# Altium project KeyboardMoudle.PrjPCB
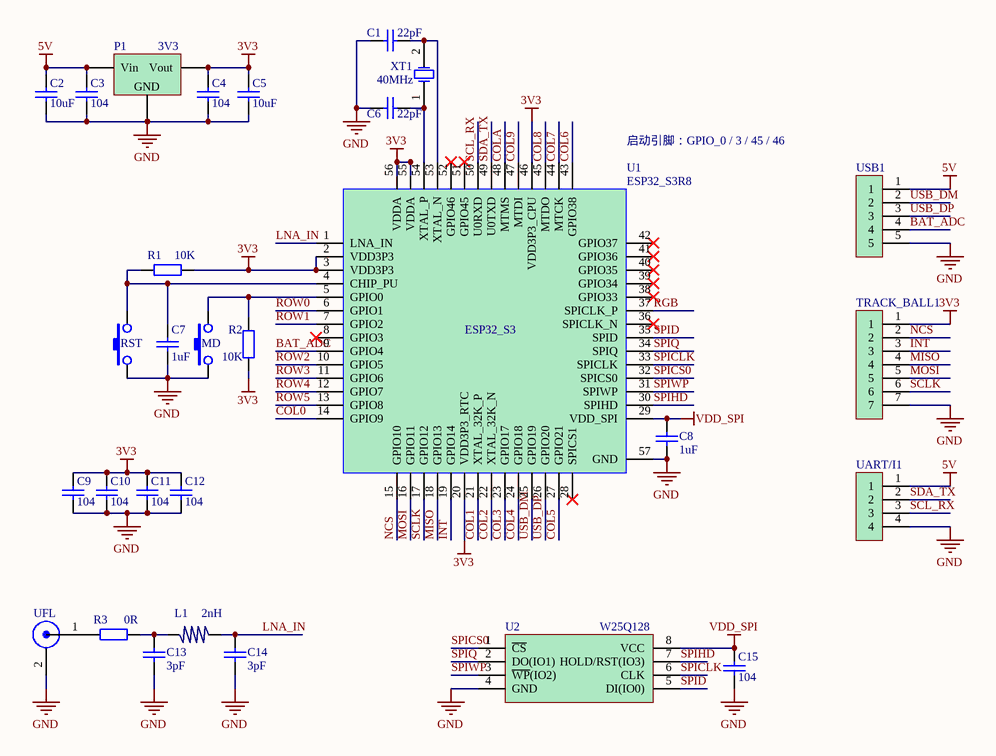
[diagram p0: KeyboardMoudle1.SchDoc]
3 sheets, 309 parts. Net scope: global (net labels, ports and power ports of the same name join across sheets).
Board file: KeyboardMoudle.PcbDoc
Sheets:
  KeyboardMoudle1.SchDoc
  KeyboardMoudle2.SchDoc
  KeyboardMoudle3.SchDoc

## Sheet KeyboardMoudle1.SchDoc
size A4

### Parts
C1  22pF  [0603]
C2  10uF  [0603]
C3  104  [0603]
C4  104  [0603]
C5  10uF  [0603]
C6  22pF  [0603]
C7  1uF  [0603]
C8  1uF  [0603]
C9  104  [0603]
C10  104  [0603]
C11  104  [0603]
C12  104  [0603]
C13  3pF  [0603]
C14  3pF  [0603]
C15  104  [0603]
L1  2nH  [0603]
MD  KEY  [KEY_SMT_4_L]  (value not drawn)
P1  3V3  [SOT223]
R1  10K  [R_0603]
R2  10K  [R_0603]
R3  0R  [R_0603]
RST  KEY  [KEY_SMT_4_L]  (value not drawn)
TRACK_BALL1  SH1.25mm_7P  [SH1.25MM_7P]  (value not drawn)
U1  ESP32_S3R8  [QFN56]
U2  W25Q128  [SOIC8-208MIL]
UART/I1  SH1.25mm_4P  [SH1.25MM_4P]  (value not drawn)
UFL  UFL  [IPEX]  (value not drawn)
USB1  SH1.25mm_5P  [SH1.25MM_5P]  (value not drawn)
XT1  40MHz  [XTAL_5032]

### Nets
3V3: C4.2 C5.2 C9.2 C10.2 C11.2 C12.2 P1.2(Vout) R1.1 R2.1 TRACK_BALL1.1 U1.2(VDD3P3) U1.3(VDD3P3) U1.20(VDD3P3_RTC) U1.46(VDD3P3_CPU) U1.55(VDDA) U1.56(VDDA)
5V: C2.2 C3.2 P1.3(Vin) UART/I1.1 USB1.1
GND: C1.1 C2.1 C3.1 C4.1 C5.1 C6.2 C7.2 C8.2 C9.1 C10.1 C11.1 C12.1 C13.2 C14.2 C15.2 MD.1 P1.1(GND) RST.1 TRACK_BALL1.7 U1.57(GND) U2.4(GND) UART/I1.4 UFL.2 USB1.5
VDD_SPI: C8.1 C15.1 U1.29(VDD_SPI) U2.8(VCC)
BAT_ADC: U1.9(GPIO4) USB1.4
COL0: U1.14(GPIO9)
COL1: U1.21(XTAL_32K_P)
COL2: U1.22(XTAL_32K_N)
COL3: U1.23(GPIO17)
COL4: U1.24(GPIO18)
COL5: U1.27(GPIO21)
COL6: U1.43(GPIO38)
COL7: U1.44(MTCK)
COL8: U1.45(MTDO)
COL9: U1.47(MTDI)
COLA: U1.48(MTMS)
INT: TRACK_BALL1.3 U1.19(GPIO14)
LNA_IN: C14.1 L1.2 U1.1(LNA_IN)
MISO: TRACK_BALL1.4 U1.18(GPIO13)
MOSI: TRACK_BALL1.5 U1.16(GPIO11)
NCS: TRACK_BALL1.2 U1.15(GPIO10)
RGB: U1.37(SPICLK_P)
ROW0: U1.6(GPIO1)
ROW1: U1.7(GPIO2)
ROW2: U1.10(GPIO5)
ROW3: U1.11(GPIO6)
ROW4: U1.12(GPIO7)
ROW5: U1.13(GPIO8)
SCL_RX: U1.50(U0RXD) UART/I1.3
SCLK: TRACK_BALL1.6 U1.17(GPIO12)
SDA_TX: U1.49(U0TXD) UART/I1.2
SPICLK: U1.33(SPICLK) U2.6(CLK)
SPICS0: U1.32(SPICS0) U2.1(~{CS})
SPID: U1.35(SPID) U2.5(DI(IO0))
SPIHD: U1.30(SPIHD) U2.7(HOLD/RST(IO3))
SPIQ: U1.34(SPIQ) U2.2(DO(IO1))
SPIWP: U1.31(SPIWP) U2.3(~{WP}(IO2))
USB_DM: U1.25(GPIO19) USB1.2
USB_DP: U1.26(GPIO20) USB1.3
NetC1_2: C1.2 U1.53(XTAL_N) XT1.2(OSC2)
NetC6_1: C6.1 U1.54(XTAL_P) XT1.1(OSC1)
NetC7_1: C7.1 R1.2 RST.2 U1.4(CHIP_PU)
NetC13_1: C13.1 L1.1 R3.2
NetMD_2: MD.2 R2.2 U1.5(GPIO0)
NetR3_1: R3.1 UFL.1

Not connected (* = marked no-connect by the designer): U1 8(GPIO3)* 28(SPICS1)* 36(SPICLK_N)* 38(GPIO33)* 39(GPIO34)* 40(GPIO35)* 41(GPIO36)* 42(GPIO37)* 51(GPIO45)* 52(GPIO46)*

### Notes on the sheet
- (near U1) 启动引脚：GPIO_0 / 3 / 45 / 46

### Library data of the parts
C1-C15 = CAP_0603: 贴片电容 0603
L1 = L_0603: 电感 0603
MD RST = KEY_SMT_4_L: 卧式贴片按键 2*4*3.5mm
P1 = LDO_AMS1117: 线性稳压器
R1-R3 = RES_0603: 电阻 0603
U1 = ESP32_S3: ESP32
U2 = W25Q64: FLASH
UFL = UFL: 射频接口
XT1 = XTAL_5032: 贴片无源晶振

## Sheet KeyboardMoudle2.SchDoc
size A4
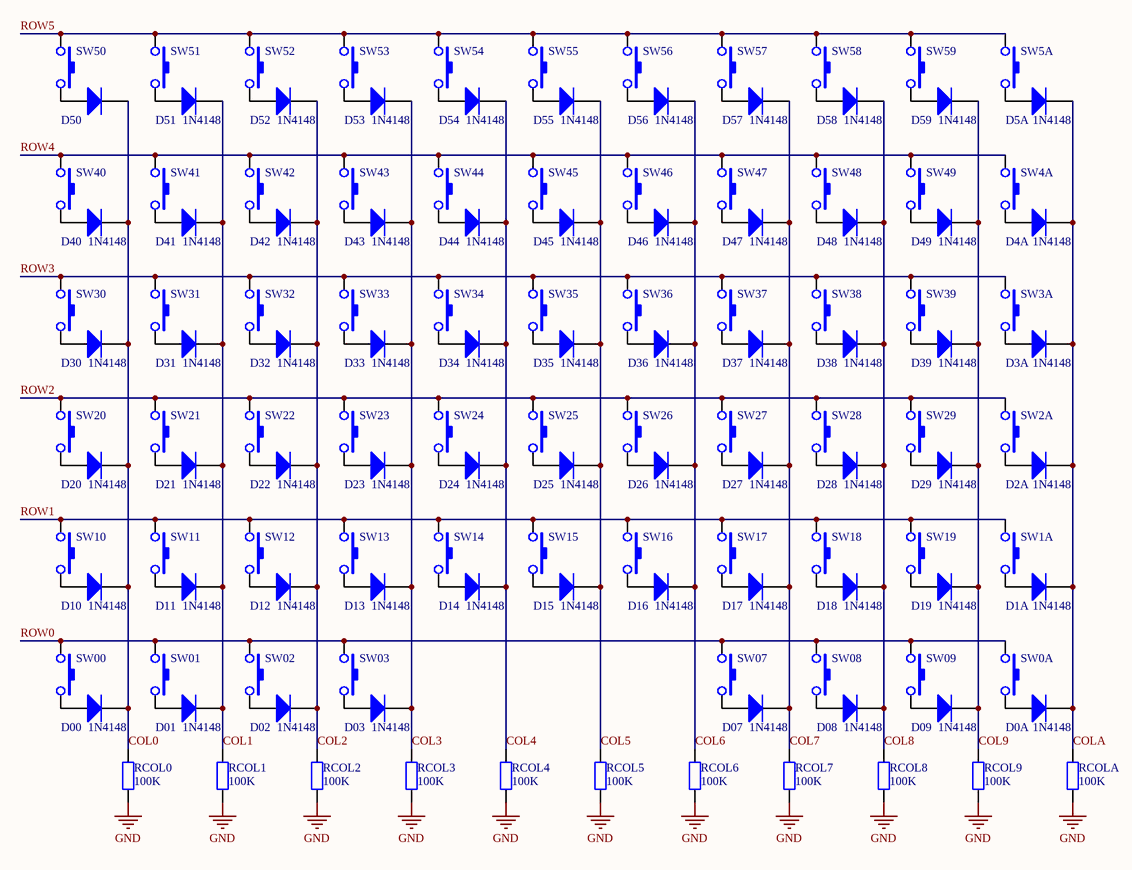
[diagram p1: KeyboardMoudle2.SchDoc]

### Parts
D00  1N4148  [SOD523]
D0A  1N4148  [SOD523]
D01  1N4148  [SOD523]
D1A  1N4148  [SOD523]
D02  1N4148  [SOD523]
D2A  1N4148  [SOD523]
D03  1N4148  [SOD523]
D3A  1N4148  [SOD523]
D4A  1N4148  [SOD523]
D5A  1N4148  [SOD523]
D07  1N4148  [SOD523]
D08  1N4148  [SOD523]
D09  1N4148  [SOD523]
D10  1N4148  [SOD523]
D11  1N4148  [SOD523]
D12  1N4148  [SOD523]
D13  1N4148  [SOD523]
D14  1N4148  [SOD523]
D15  1N4148  [SOD523]
D16  1N4148  [SOD523]
D17  1N4148  [SOD523]
D18  1N4148  [SOD523]
D19  1N4148  [SOD523]
D20  1N4148  [SOD523]
D21  1N4148  [SOD523]
D22  1N4148  [SOD523]
D23  1N4148  [SOD523]
D24  1N4148  [SOD523]
D25  1N4148  [SOD523]
D26  1N4148  [SOD523]
D27  1N4148  [SOD523]
D28  1N4148  [SOD523]
D29  1N4148  [SOD523]
D30  1N4148  [SOD523]
D31  1N4148  [SOD523]
D32  1N4148  [SOD523]
D33  1N4148  [SOD523]
D34  1N4148  [SOD523]
D35  1N4148  [SOD523]
D36  1N4148  [SOD523]
D37  1N4148  [SOD523]
D38  1N4148  [SOD523]
D39  1N4148  [SOD523]
D40  1N4148  [SOD523]
D41  1N4148  [SOD523]
D42  1N4148  [SOD523]
D43  1N4148  [SOD523]
D44  1N4148  [SOD523]
D45  1N4148  [SOD523]
D46  1N4148  [SOD523]
D47  1N4148  [SOD523]
D48  1N4148  [SOD523]
D49  1N4148  [SOD523]
D50  (no value)  [SOD523]
D51  1N4148  [SOD523]
D52  1N4148  [SOD523]
D53  1N4148  [SOD523]
D54  1N4148  [SOD523]
D55  1N4148  [SOD523]
D56  1N4148  [SOD523]
D57  1N4148  [SOD523]
D58  1N4148  [SOD523]
D59  1N4148  [SOD523]
RCOL0  100K  [R_0603]
RCOL1  100K  [R_0603]
RCOL2  100K  [R_0603]
RCOL3  100K  [R_0603]
RCOL4  100K  [R_0603]
RCOL5  100K  [R_0603]
RCOL6  100K  [R_0603]
RCOL7  100K  [R_0603]
RCOL8  100K  [R_0603]
RCOL9  100K  [R_0603]
RCOLA  100K  [R_0603]
SW00  SWITCH_KAILH_1350  [SWITCH_KAILH_1350]  (value not drawn)
SW0A  SWITCH_KAILH_1350  [SWITCH_KAILH_1350]  (value not drawn)
SW01  SWITCH_KAILH_1350  [SWITCH_KAILH_1350]  (value not drawn)
SW1A  SWITCH_KAILH_1350  [SWITCH_KAILH_1350]  (value not drawn)
SW02  SWITCH_KAILH_1350  [SWITCH_KAILH_1350]  (value not drawn)
SW2A  SWITCH_KAILH_1350  [SWITCH_KAILH_1350]  (value not drawn)
SW03  SWITCH_KAILH_1350  [SWITCH_KAILH_1350]  (value not drawn)
SW3A  SWITCH_KAILH_1350  [SWITCH_KAILH_1350]  (value not drawn)
SW4A  SWITCH_KAILH_1350  [SWITCH_KAILH_1350]  (value not drawn)
SW5A  SWITCH_KAILH_1350  [SWITCH_KAILH_1350]  (value not drawn)
SW07  SWITCH_KAILH_1350  [SWITCH_KAILH_1350]  (value not drawn)
SW08  SWITCH_KAILH_1350  [SWITCH_KAILH_1350]  (value not drawn)
SW09  SWITCH_KAILH_1350  [SWITCH_KAILH_1350]  (value not drawn)
SW10  SWITCH_KAILH_1350  [SWITCH_KAILH_1350]  (value not drawn)
SW11  SWITCH_KAILH_1350  [SWITCH_KAILH_1350]  (value not drawn)
SW12  SWITCH_KAILH_1350  [SWITCH_KAILH_1350]  (value not drawn)
SW13  SWITCH_KAILH_1350  [SWITCH_KAILH_1350]  (value not drawn)
SW14  SWITCH_KAILH_1350  [SWITCH_KAILH_1350]  (value not drawn)
SW15  SWITCH_KAILH_1350  [SWITCH_KAILH_1350]  (value not drawn)
SW16  SWITCH_KAILH_1350  [SWITCH_KAILH_1350]  (value not drawn)
SW17  SWITCH_KAILH_1350  [SWITCH_KAILH_1350]  (value not drawn)
SW18  SWITCH_KAILH_1350  [SWITCH_KAILH_1350]  (value not drawn)
SW19  SWITCH_KAILH_1350  [SWITCH_KAILH_1350]  (value not drawn)
SW20  SWITCH_KAILH_1350  [SWITCH_KAILH_1350]  (value not drawn)
SW21  SWITCH_KAILH_1350  [SWITCH_KAILH_1350]  (value not drawn)
SW22  SWITCH_KAILH_1350  [SWITCH_KAILH_1350]  (value not drawn)
SW23  SWITCH_KAILH_1350  [SWITCH_KAILH_1350]  (value not drawn)
SW24  SWITCH_KAILH_1350  [SWITCH_KAILH_1350]  (value not drawn)
SW25  SWITCH_KAILH_1350  [SWITCH_KAILH_1350]  (value not drawn)
SW26  SWITCH_KAILH_1350  [SWITCH_KAILH_1350]  (value not drawn)
SW27  SWITCH_KAILH_1350  [SWITCH_KAILH_1350]  (value not drawn)
SW28  SWITCH_KAILH_1350  [SWITCH_KAILH_1350]  (value not drawn)
SW29  SWITCH_KAILH_1350  [SWITCH_KAILH_1350]  (value not drawn)
SW30  SWITCH_KAILH_1350  [SWITCH_KAILH_1350]  (value not drawn)
SW31  SWITCH_KAILH_1350  [SWITCH_KAILH_1350]  (value not drawn)
SW32  SWITCH_KAILH_1350  [SWITCH_KAILH_1350]  (value not drawn)
SW33  SWITCH_KAILH_1350  [SWITCH_KAILH_1350]  (value not drawn)
SW34  SWITCH_KAILH_1350  [SWITCH_KAILH_1350]  (value not drawn)
SW35  SWITCH_KAILH_1350  [SWITCH_KAILH_1350]  (value not drawn)
SW36  SWITCH_KAILH_1350  [SWITCH_KAILH_1350]  (value not drawn)
SW37  SWITCH_KAILH_1350  [SWITCH_KAILH_1350]  (value not drawn)
SW38  SWITCH_KAILH_1350  [SWITCH_KAILH_1350]  (value not drawn)
SW39  SWITCH_KAILH_1350  [SWITCH_KAILH_1350]  (value not drawn)
SW40  SWITCH_KAILH_1350  [SWITCH_KAILH_1350]  (value not drawn)
SW41  SWITCH_KAILH_1350  [SWITCH_KAILH_1350]  (value not drawn)
SW42  SWITCH_KAILH_1350  [SWITCH_KAILH_1350]  (value not drawn)
SW43  SWITCH_KAILH_1350  [SWITCH_KAILH_1350]  (value not drawn)
SW44  SWITCH_KAILH_1350  [SWITCH_KAILH_1350]  (value not drawn)
SW45  SWITCH_KAILH_1350  [SWITCH_KAILH_1350]  (value not drawn)
SW46  SWITCH_KAILH_1350  [SWITCH_KAILH_1350]  (value not drawn)
SW47  SWITCH_KAILH_1350  [SWITCH_KAILH_1350]  (value not drawn)
SW48  SWITCH_KAILH_1350  [SWITCH_KAILH_1350]  (value not drawn)
SW49  SWITCH_KAILH_1350  [SWITCH_KAILH_1350]  (value not drawn)
SW50  SWITCH_KAILH_1350  [SWITCH_KAILH_1350]  (value not drawn)
SW51  SWITCH_KAILH_1350  [SWITCH_KAILH_1350]  (value not drawn)
SW52  SWITCH_KAILH_1350  [SWITCH_KAILH_1350]  (value not drawn)
SW53  SWITCH_KAILH_1350  [SWITCH_KAILH_1350]  (value not drawn)
SW54  SWITCH_KAILH_1350  [SWITCH_KAILH_1350]  (value not drawn)
SW55  SWITCH_KAILH_1350  [SWITCH_KAILH_1350]  (value not drawn)
SW56  SWITCH_KAILH_1350  [SWITCH_KAILH_1350]  (value not drawn)
SW57  SWITCH_KAILH_1350  [SWITCH_KAILH_1350]  (value not drawn)
SW58  SWITCH_KAILH_1350  [SWITCH_KAILH_1350]  (value not drawn)
SW59  SWITCH_KAILH_1350  [SWITCH_KAILH_1350]  (value not drawn)

### Nets
GND: RCOL0.1 RCOL1.1 RCOL2.1 RCOL3.1 RCOL4.1 RCOL5.1 RCOL6.1 RCOL7.1 RCOL8.1 RCOL9.1 RCOLA.1
COL0: D00.2(K) D10.2(K) D20.2(K) D30.2(K) D40.2(K) D50.2(K) RCOL0.2
COL1: D01.2(K) D11.2(K) D21.2(K) D31.2(K) D41.2(K) D51.2(K) RCOL1.2
COL2: D02.2(K) D12.2(K) D22.2(K) D32.2(K) D42.2(K) D52.2(K) RCOL2.2
COL3: D03.2(K) D13.2(K) D23.2(K) D33.2(K) D43.2(K) D53.2(K) RCOL3.2
COL4: D14.2(K) D24.2(K) D34.2(K) D44.2(K) D54.2(K) RCOL4.2
COL5: D15.2(K) D25.2(K) D35.2(K) D45.2(K) D55.2(K) RCOL5.2
COL6: D16.2(K) D26.2(K) D36.2(K) D46.2(K) D56.2(K) RCOL6.2
COL7: D07.2(K) D17.2(K) D27.2(K) D37.2(K) D47.2(K) D57.2(K) RCOL7.2
COL8: D08.2(K) D18.2(K) D28.2(K) D38.2(K) D48.2(K) D58.2(K) RCOL8.2
COL9: D09.2(K) D19.2(K) D29.2(K) D39.2(K) D49.2(K) D59.2(K) RCOL9.2
COLA: D0A.2(K) D1A.2(K) D2A.2(K) D3A.2(K) D4A.2(K) D5A.2(K) RCOLA.2
ROW0: SW00.1 SW0A.1 SW01.1 SW02.1 SW03.1 SW07.1 SW08.1 SW09.1
ROW1: SW1A.1 SW10.1 SW11.1 SW12.1 SW13.1 SW14.1 SW15.1 SW16.1 SW17.1 SW18.1 SW19.1
ROW2: SW2A.1 SW20.1 SW21.1 SW22.1 SW23.1 SW24.1 SW25.1 SW26.1 SW27.1 SW28.1 SW29.1
ROW3: SW3A.1 SW30.1 SW31.1 SW32.1 SW33.1 SW34.1 SW35.1 SW36.1 SW37.1 SW38.1 SW39.1
ROW4: SW4A.1 SW40.1 SW41.1 SW42.1 SW43.1 SW44.1 SW45.1 SW46.1 SW47.1 SW48.1 SW49.1
ROW5: SW5A.1 SW50.1 SW51.1 SW52.1 SW53.1 SW54.1 SW55.1 SW56.1 SW57.1 SW58.1 SW59.1
NetD00_1: D00.1(A) SW00.2
NetD0A_1: D0A.1(A) SW0A.2
NetD01_1: D01.1(A) SW01.2
NetD1A_1: D1A.1(A) SW1A.2
NetD02_1: D02.1(A) SW02.2
NetD2A_1: D2A.1(A) SW2A.2
NetD03_1: D03.1(A) SW03.2
NetD3A_1: D3A.1(A) SW3A.2
NetD4A_1: D4A.1(A) SW4A.2
NetD5A_1: D5A.1(A) SW5A.2
NetD07_1: D07.1(A) SW07.2
NetD08_1: D08.1(A) SW08.2
NetD09_1: D09.1(A) SW09.2
NetD10_1: D10.1(A) SW10.2
NetD11_1: D11.1(A) SW11.2
NetD12_1: D12.1(A) SW12.2
NetD13_1: D13.1(A) SW13.2
NetD14_1: D14.1(A) SW14.2
NetD15_1: D15.1(A) SW15.2
NetD16_1: D16.1(A) SW16.2
NetD17_1: D17.1(A) SW17.2
NetD18_1: D18.1(A) SW18.2
NetD19_1: D19.1(A) SW19.2
NetD20_1: D20.1(A) SW20.2
NetD21_1: D21.1(A) SW21.2
NetD22_1: D22.1(A) SW22.2
NetD23_1: D23.1(A) SW23.2
NetD24_1: D24.1(A) SW24.2
NetD25_1: D25.1(A) SW25.2
NetD26_1: D26.1(A) SW26.2
NetD27_1: D27.1(A) SW27.2
NetD28_1: D28.1(A) SW28.2
NetD29_1: D29.1(A) SW29.2
NetD30_1: D30.1(A) SW30.2
NetD31_1: D31.1(A) SW31.2
NetD32_1: D32.1(A) SW32.2
NetD33_1: D33.1(A) SW33.2
NetD34_1: D34.1(A) SW34.2
NetD35_1: D35.1(A) SW35.2
NetD36_1: D36.1(A) SW36.2
NetD37_1: D37.1(A) SW37.2
NetD38_1: D38.1(A) SW38.2
NetD39_1: D39.1(A) SW39.2
NetD40_1: D40.1(A) SW40.2
NetD41_1: D41.1(A) SW41.2
NetD42_1: D42.1(A) SW42.2
NetD43_1: D43.1(A) SW43.2
NetD44_1: D44.1(A) SW44.2
NetD45_1: D45.1(A) SW45.2
NetD46_1: D46.1(A) SW46.2
NetD47_1: D47.1(A) SW47.2
NetD48_1: D48.1(A) SW48.2
NetD49_1: D49.1(A) SW49.2
NetD50_1: D50.1(A) SW50.2
NetD51_1: D51.1(A) SW51.2
NetD52_1: D52.1(A) SW52.2
NetD53_1: D53.1(A) SW53.2
NetD54_1: D54.1(A) SW54.2
NetD55_1: D55.1(A) SW55.2
NetD56_1: D56.1(A) SW56.2
NetD57_1: D57.1(A) SW57.2
NetD58_1: D58.1(A) SW58.2
NetD59_1: D59.1(A) SW59.2

### Library data of the parts
D00 D0A D01 D1A D02 D2A D03 D3A D4A D5A D07 D08 D09-D59 = DIO_1N4148_SOD523: 开关二极管
RCOL0-RCOL9 RCOLA = RES_0603: 电阻 0603
SW00 SW0A SW01 SW1A SW02 SW2A SW03 SW3A SW4A SW5A SW07 SW08 SW09-SW59 = SWITCH_KAILH_1350: 凯华机械矮轴1350

## Sheet KeyboardMoudle3.SchDoc
size A4
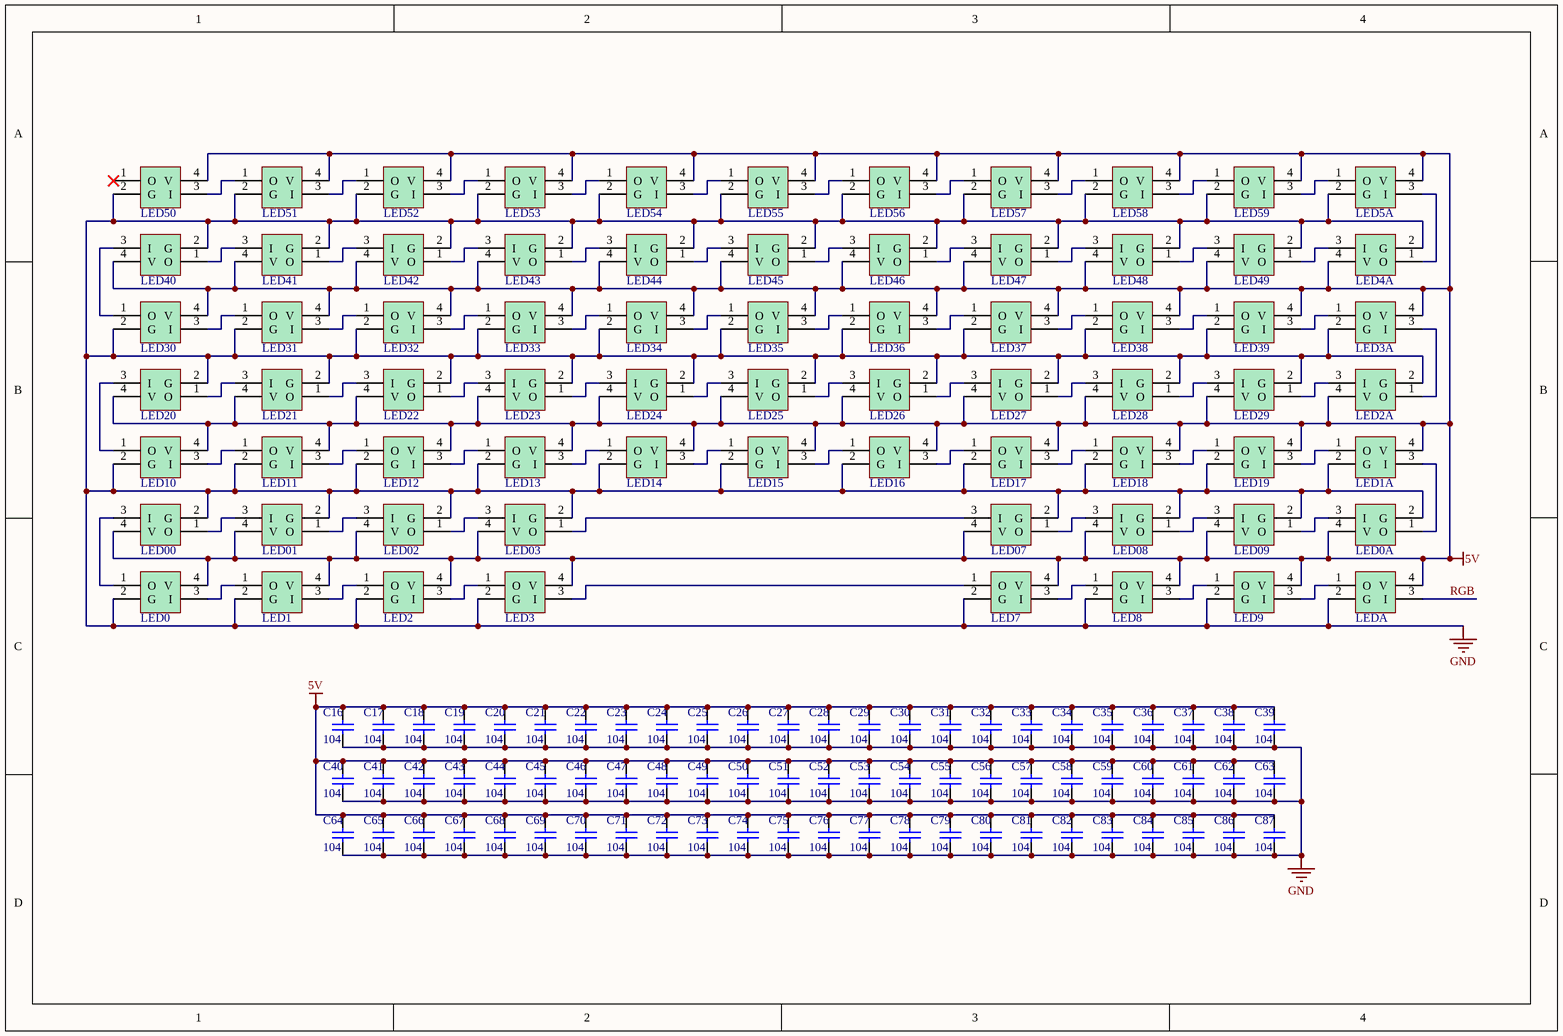
[diagram p2: KeyboardMoudle3.SchDoc]

### Parts
C16  104  [0603]
C17  104  [0603]
C18  104  [0603]
C19  104  [0603]
C20  104  [0603]
C21  104  [0603]
C22  104  [0603]
C23  104  [0603]
C24  104  [0603]
C25  104  [0603]
C26  104  [0603]
C27  104  [0603]
C28  104  [0603]
C29  104  [0603]
C30  104  [0603]
C31  104  [0603]
C32  104  [0603]
C33  104  [0603]
C34  104  [0603]
C35  104  [0603]
C36  104  [0603]
C37  104  [0603]
C38  104  [0603]
C39  104  [0603]
C40  104  [0603]
C41  104  [0603]
C42  104  [0603]
C43  104  [0603]
C44  104  [0603]
C45  104  [0603]
C46  104  [0603]
C47  104  [0603]
C48  104  [0603]
C49  104  [0603]
C50  104  [0603]
C51  104  [0603]
C52  104  [0603]
C53  104  [0603]
C54  104  [0603]
C55  104  [0603]
C56  104  [0603]
C57  104  [0603]
C58  104  [0603]
C59  104  [0603]
C60  104  [0603]
C61  104  [0603]
C62  104  [0603]
C63  104  [0603]
C64  104  [0603]
C65  104  [0603]
C66  104  [0603]
C67  104  [0603]
C68  104  [0603]
C69  104  [0603]
C70  104  [0603]
C71  104  [0603]
C72  104  [0603]
C73  104  [0603]
C74  104  [0603]
C75  104  [0603]
C76  104  [0603]
C77  104  [0603]
C78  104  [0603]
C79  104  [0603]
C80  104  [0603]
C81  104  [0603]
C82  104  [0603]
C83  104  [0603]
C84  104  [0603]
C85  104  [0603]
C86  104  [0603]
C87  104  [0603]
LED00  WS2812  [LED_WS2812_2020]  (value not drawn)
LED0  WS2812  [LED_WS2812_2020]  (value not drawn)
LED0A  WS2812  [LED_WS2812_2020]  (value not drawn)
LED01  WS2812  [LED_WS2812_2020]  (value not drawn)
LED1  WS2812  [LED_WS2812_2020]  (value not drawn)
LED1A  WS2812  [LED_WS2812_2020]  (value not drawn)
LED02  WS2812  [LED_WS2812_2020]  (value not drawn)
LED2  WS2812  [LED_WS2812_2020]  (value not drawn)
LED2A  WS2812  [LED_WS2812_2020]  (value not drawn)
LED03  WS2812  [LED_WS2812_2020]  (value not drawn)
LED3  WS2812  [LED_WS2812_2020]  (value not drawn)
LED3A  WS2812  [LED_WS2812_2020]  (value not drawn)
LED4A  WS2812  [LED_WS2812_2020]  (value not drawn)
LED5A  WS2812  [LED_WS2812_2020]  (value not drawn)
LED07  WS2812  [LED_WS2812_2020]  (value not drawn)
LED7  WS2812  [LED_WS2812_2020]  (value not drawn)
LED08  WS2812  [LED_WS2812_2020]  (value not drawn)
LED8  WS2812  [LED_WS2812_2020]  (value not drawn)
LED09  WS2812  [LED_WS2812_2020]  (value not drawn)
LED9  WS2812  [LED_WS2812_2020]  (value not drawn)
LED10  WS2812  [LED_WS2812_2020]  (value not drawn)
LED11  WS2812  [LED_WS2812_2020]  (value not drawn)
LED12  WS2812  [LED_WS2812_2020]  (value not drawn)
LED13  WS2812  [LED_WS2812_2020]  (value not drawn)
LED14  WS2812  [LED_WS2812_2020]  (value not drawn)
LED15  WS2812  [LED_WS2812_2020]  (value not drawn)
LED16  WS2812  [LED_WS2812_2020]  (value not drawn)
LED17  WS2812  [LED_WS2812_2020]  (value not drawn)
LED18  WS2812  [LED_WS2812_2020]  (value not drawn)
LED19  WS2812  [LED_WS2812_2020]  (value not drawn)
LED20  WS2812  [LED_WS2812_2020]  (value not drawn)
LED21  WS2812  [LED_WS2812_2020]  (value not drawn)
LED22  WS2812  [LED_WS2812_2020]  (value not drawn)
LED23  WS2812  [LED_WS2812_2020]  (value not drawn)
LED24  WS2812  [LED_WS2812_2020]  (value not drawn)
LED25  WS2812  [LED_WS2812_2020]  (value not drawn)
LED26  WS2812  [LED_WS2812_2020]  (value not drawn)
LED27  WS2812  [LED_WS2812_2020]  (value not drawn)
LED28  WS2812  [LED_WS2812_2020]  (value not drawn)
LED29  WS2812  [LED_WS2812_2020]  (value not drawn)
LED30  WS2812  [LED_WS2812_2020]  (value not drawn)
LED31  WS2812  [LED_WS2812_2020]  (value not drawn)
LED32  WS2812  [LED_WS2812_2020]  (value not drawn)
LED33  WS2812  [LED_WS2812_2020]  (value not drawn)
LED34  WS2812  [LED_WS2812_2020]  (value not drawn)
LED35  WS2812  [LED_WS2812_2020]  (value not drawn)
LED36  WS2812  [LED_WS2812_2020]  (value not drawn)
LED37  WS2812  [LED_WS2812_2020]  (value not drawn)
LED38  WS2812  [LED_WS2812_2020]  (value not drawn)
LED39  WS2812  [LED_WS2812_2020]  (value not drawn)
LED40  WS2812  [LED_WS2812_2020]  (value not drawn)
LED41  WS2812  [LED_WS2812_2020]  (value not drawn)
LED42  WS2812  [LED_WS2812_2020]  (value not drawn)
LED43  WS2812  [LED_WS2812_2020]  (value not drawn)
LED44  WS2812  [LED_WS2812_2020]  (value not drawn)
LED45  WS2812  [LED_WS2812_2020]  (value not drawn)
LED46  WS2812  [LED_WS2812_2020]  (value not drawn)
LED47  WS2812  [LED_WS2812_2020]  (value not drawn)
LED48  WS2812  [LED_WS2812_2020]  (value not drawn)
LED49  WS2812  [LED_WS2812_2020]  (value not drawn)
LED50  WS2812  [LED_WS2812_2020]  (value not drawn)
LED51  WS2812  [LED_WS2812_2020]  (value not drawn)
LED52  WS2812  [LED_WS2812_2020]  (value not drawn)
LED53  WS2812  [LED_WS2812_2020]  (value not drawn)
LED54  WS2812  [LED_WS2812_2020]  (value not drawn)
LED55  WS2812  [LED_WS2812_2020]  (value not drawn)
LED56  WS2812  [LED_WS2812_2020]  (value not drawn)
LED57  WS2812  [LED_WS2812_2020]  (value not drawn)
LED58  WS2812  [LED_WS2812_2020]  (value not drawn)
LED59  WS2812  [LED_WS2812_2020]  (value not drawn)
LEDA  WS2812  [LED_WS2812_2020]  (value not drawn)

### Nets
5V: C16.2 C17.2 C18.2 C19.2 C20.2 C21.2 C22.2 C23.2 C24.2 C25.2 C26.2 C27.2 C28.2 C29.2 C30.2 C31.2 C32.2 C33.2 C34.2 C35.2 C36.2 C37.2 C38.2 C39.2 C40.2 C41.2 C42.2 C43.2 C44.2 C45.2 C46.2 C47.2 C48.2 C49.2 C50.2 C51.2 C52.2 C53.2 C54.2 C55.2 C56.2 C57.2 C58.2 C59.2 C60.2 C61.2 C62.2 C63.2 C64.2 C65.2 C66.2 C67.2 C68.2 C69.2 C70.2 C71.2 C72.2 C73.2 C74.2 C75.2 C76.2 C77.2 C78.2 C79.2 C80.2 C81.2 C82.2 C83.2 C84.2 C85.2 C86.2 C87.2 LED00.4(V) LED0.4(V) LED0A.4(V) LED01.4(V) LED1.4(V) LED1A.4(V) LED02.4(V) LED2.4(V) LED2A.4(V) LED03.4(V) LED3.4(V) LED3A.4(V) LED4A.4(V) LED5A.4(V) LED07.4(V) LED7.4(V) LED08.4(V) LED8.4(V) LED09.4(V) LED9.4(V) LED10.4(V) LED11.4(V) LED12.4(V) LED13.4(V) LED14.4(V) LED15.4(V) LED16.4(V) LED17.4(V) LED18.4(V) LED19.4(V) LED20.4(V) LED21.4(V) LED22.4(V) LED23.4(V) LED24.4(V) LED25.4(V) LED26.4(V) LED27.4(V) LED28.4(V) LED29.4(V) LED30.4(V) LED31.4(V) LED32.4(V) LED33.4(V) LED34.4(V) LED35.4(V) LED36.4(V) LED37.4(V) LED38.4(V) LED39.4(V) LED40.4(V) LED41.4(V) LED42.4(V) LED43.4(V) LED44.4(V) LED45.4(V) LED46.4(V) LED47.4(V) LED48.4(V) LED49.4(V) LED50.4(V) LED51.4(V) LED52.4(V) LED53.4(V) LED54.4(V) LED55.4(V) LED56.4(V) LED57.4(V) LED58.4(V) LED59.4(V) LEDA.4(V)
GND: C16.1 C17.1 C18.1 C19.1 C20.1 C21.1 C22.1 C23.1 C24.1 C25.1 C26.1 C27.1 C28.1 C29.1 C30.1 C31.1 C32.1 C33.1 C34.1 C35.1 C36.1 C37.1 C38.1 C39.1 C40.1 C41.1 C42.1 C43.1 C44.1 C45.1 C46.1 C47.1 C48.1 C49.1 C50.1 C51.1 C52.1 C53.1 C54.1 C55.1 C56.1 C57.1 C58.1 C59.1 C60.1 C61.1 C62.1 C63.1 C64.1 C65.1 C66.1 C67.1 C68.1 C69.1 C70.1 C71.1 C72.1 C73.1 C74.1 C75.1 C76.1 C77.1 C78.1 C79.1 C80.1 C81.1 C82.1 C83.1 C84.1 C85.1 C86.1 C87.1 LED00.2(G) LED0.2(G) LED0A.2(G) LED01.2(G) LED1.2(G) LED1A.2(G) LED02.2(G) LED2.2(G) LED2A.2(G) LED03.2(G) LED3.2(G) LED3A.2(G) LED4A.2(G) LED5A.2(G) LED07.2(G) LED7.2(G) LED08.2(G) LED8.2(G) LED09.2(G) LED9.2(G) LED10.2(G) LED11.2(G) LED12.2(G) LED13.2(G) LED14.2(G) LED15.2(G) LED16.2(G) LED17.2(G) LED18.2(G) LED19.2(G) LED20.2(G) LED21.2(G) LED22.2(G) LED23.2(G) LED24.2(G) LED25.2(G) LED26.2(G) LED27.2(G) LED28.2(G) LED29.2(G) LED30.2(G) LED31.2(G) LED32.2(G) LED33.2(G) LED34.2(G) LED35.2(G) LED36.2(G) LED37.2(G) LED38.2(G) LED39.2(G) LED40.2(G) LED41.2(G) LED42.2(G) LED43.2(G) LED44.2(G) LED45.2(G) LED46.2(G) LED47.2(G) LED48.2(G) LED49.2(G) LED50.2(G) LED51.2(G) LED52.2(G) LED53.2(G) LED54.2(G) LED55.2(G) LED56.2(G) LED57.2(G) LED58.2(G) LED59.2(G) LEDA.2(G)
RGB: LEDA.3(I)
NetLED0_1: LED0.1(O) LED00.3(I)
NetLED00_1: LED00.1(O) LED01.3(I)
NetLED0_3: LED0.3(I) LED1.1(O)
NetLED0A_1: LED0A.1(O) LED1A.3(I)
NetLED0A_3: LED0A.3(I) LED09.1(O)
NetLED01_1: LED01.1(O) LED02.3(I)
NetLED1_3: LED1.3(I) LED2.1(O)
NetLED1A_1: LED1A.1(O) LED19.3(I)
NetLED02_1: LED02.1(O) LED03.3(I)
NetLED2_3: LED2.3(I) LED3.1(O)
NetLED2A_1: LED2A.1(O) LED3A.3(I)
NetLED2A_3: LED2A.3(I) LED29.1(O)
NetLED03_1: LED03.1(O) LED07.3(I)
NetLED3_3: LED3.3(I) LED7.1(O)
NetLED3A_1: LED3A.1(O) LED39.3(I)
NetLED4A_1: LED4A.1(O) LED5A.3(I)
NetLED4A_3: LED4A.3(I) LED49.1(O)
NetLED5A_1: LED5A.1(O) LED59.3(I)
NetLED07_1: LED07.1(O) LED08.3(I)
NetLED7_3: LED7.3(I) LED8.1(O)
NetLED08_1: LED08.1(O) LED09.3(I)
NetLED8_3: LED8.3(I) LED9.1(O)
NetLED9_3: LED9.3(I) LEDA.1(O)
NetLED10_1: LED10.1(O) LED20.3(I)
NetLED10_3: LED10.3(I) LED11.1(O)
NetLED11_3: LED11.3(I) LED12.1(O)
NetLED12_3: LED12.3(I) LED13.1(O)
NetLED13_3: LED13.3(I) LED14.1(O)
NetLED14_3: LED14.3(I) LED15.1(O)
NetLED15_3: LED15.3(I) LED16.1(O)
NetLED16_3: LED16.3(I) LED17.1(O)
NetLED17_3: LED17.3(I) LED18.1(O)
NetLED18_3: LED18.3(I) LED19.1(O)
NetLED20_1: LED20.1(O) LED21.3(I)
NetLED21_1: LED21.1(O) LED22.3(I)
NetLED22_1: LED22.1(O) LED23.3(I)
NetLED23_1: LED23.1(O) LED24.3(I)
NetLED24_1: LED24.1(O) LED25.3(I)
NetLED25_1: LED25.1(O) LED26.3(I)
NetLED26_1: LED26.1(O) LED27.3(I)
NetLED27_1: LED27.1(O) LED28.3(I)
NetLED28_1: LED28.1(O) LED29.3(I)
NetLED30_1: LED30.1(O) LED40.3(I)
NetLED30_3: LED30.3(I) LED31.1(O)
NetLED31_3: LED31.3(I) LED32.1(O)
NetLED32_3: LED32.3(I) LED33.1(O)
NetLED33_3: LED33.3(I) LED34.1(O)
NetLED34_3: LED34.3(I) LED35.1(O)
NetLED35_3: LED35.3(I) LED36.1(O)
NetLED36_3: LED36.3(I) LED37.1(O)
NetLED37_3: LED37.3(I) LED38.1(O)
NetLED38_3: LED38.3(I) LED39.1(O)
NetLED40_1: LED40.1(O) LED41.3(I)
NetLED41_1: LED41.1(O) LED42.3(I)
NetLED42_1: LED42.1(O) LED43.3(I)
NetLED43_1: LED43.1(O) LED44.3(I)
NetLED44_1: LED44.1(O) LED45.3(I)
NetLED45_1: LED45.1(O) LED46.3(I)
NetLED46_1: LED46.1(O) LED47.3(I)
NetLED47_1: LED47.1(O) LED48.3(I)
NetLED48_1: LED48.1(O) LED49.3(I)
NetLED50_3: LED50.3(I) LED51.1(O)
NetLED51_3: LED51.3(I) LED52.1(O)
NetLED52_3: LED52.3(I) LED53.1(O)
NetLED53_3: LED53.3(I) LED54.1(O)
NetLED54_3: LED54.3(I) LED55.1(O)
NetLED55_3: LED55.3(I) LED56.1(O)
NetLED56_3: LED56.3(I) LED57.1(O)
NetLED57_3: LED57.3(I) LED58.1(O)
NetLED58_3: LED58.3(I) LED59.1(O)

Not connected (* = marked no-connect by the designer): LED50 1(O)*

### Library data of the parts
C16-C87 = CAP_0603: 贴片电容 0603
LED00 LED0 LED0A LED01 LED1 LED1A LED02 LED2 LED2A LED03 LED3 LED3A LED4A LED5A LED07 LED7 LED08 LED8 LED09 LED9-LED59 LEDA = LED_WS2812_2020: WS2812 LED

## Nets that join several sheets
5V: KeyboardMoudle1 (5 pins), KeyboardMoudle3 (143 pins)
GND: KeyboardMoudle1 (24 pins), KeyboardMoudle2 (11 pins), KeyboardMoudle3 (143 pins)
COL0: KeyboardMoudle1 (U1.14), KeyboardMoudle2 (7 pins)
COL1: KeyboardMoudle1 (U1.21), KeyboardMoudle2 (7 pins)
COL2: KeyboardMoudle1 (U1.22), KeyboardMoudle2 (7 pins)
COL3: KeyboardMoudle1 (U1.23), KeyboardMoudle2 (7 pins)
COL4: KeyboardMoudle1 (U1.24), KeyboardMoudle2 (6 pins)
COL5: KeyboardMoudle1 (U1.27), KeyboardMoudle2 (6 pins)
COL6: KeyboardMoudle1 (U1.43), KeyboardMoudle2 (6 pins)
COL7: KeyboardMoudle1 (U1.44), KeyboardMoudle2 (7 pins)
COL8: KeyboardMoudle1 (U1.45), KeyboardMoudle2 (7 pins)
COL9: KeyboardMoudle1 (U1.47), KeyboardMoudle2 (7 pins)
COLA: KeyboardMoudle1 (U1.48), KeyboardMoudle2 (7 pins)
RGB: KeyboardMoudle1 (U1.37), KeyboardMoudle3 (LEDA.3)
ROW0: KeyboardMoudle1 (U1.6), KeyboardMoudle2 (8 pins)
ROW1: KeyboardMoudle1 (U1.7), KeyboardMoudle2 (11 pins)
ROW2: KeyboardMoudle1 (U1.10), KeyboardMoudle2 (11 pins)
ROW3: KeyboardMoudle1 (U1.11), KeyboardMoudle2 (11 pins)
ROW4: KeyboardMoudle1 (U1.12), KeyboardMoudle2 (11 pins)
ROW5: KeyboardMoudle1 (U1.13), KeyboardMoudle2 (11 pins)